# Altium schematic sheet BUTTONS&LEDS.SchDoc
size A4; DocumentNumber: 11; SheetNumber: 11; SheetTotal: 12
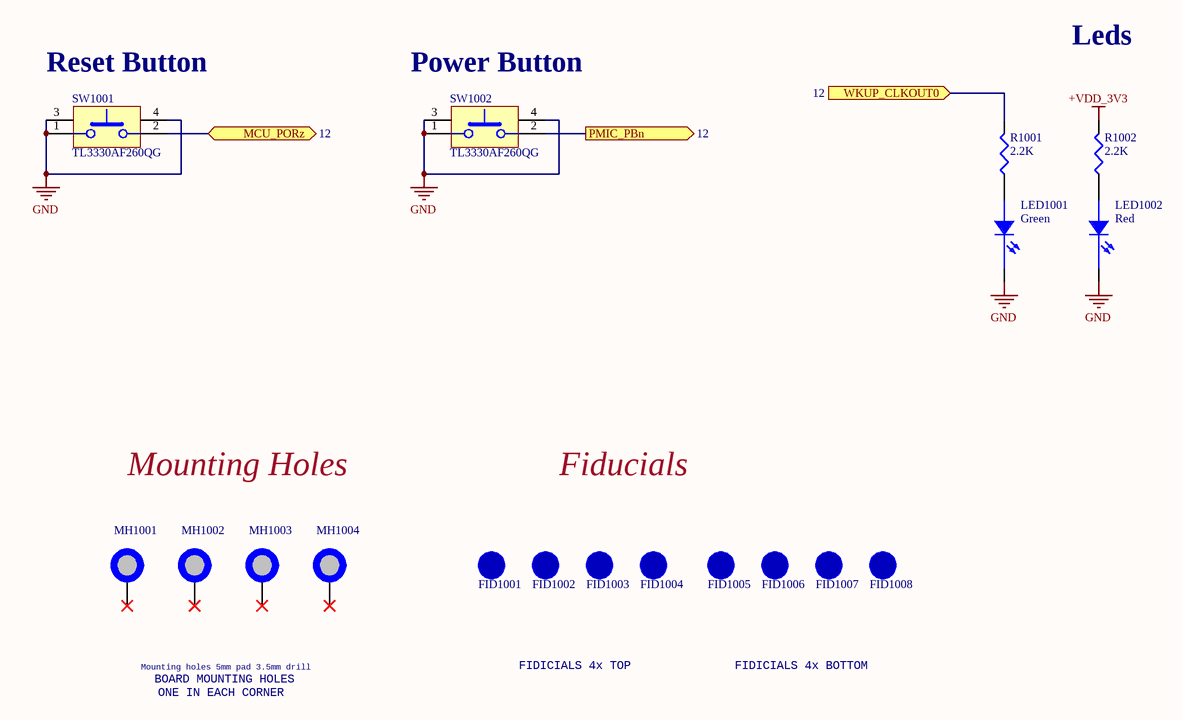
[diagram p0: BUTTONS&LEDS.SchDoc]

## Parts
FID1001  FID_1MMC  [FID_40X120D]  (value not drawn)  (no BOM)
FID1002  FID_1MMC  [FID_40X120D]  (value not drawn)  (no BOM)
FID1003  FID_1MMC  [FID_40X120D]  (value not drawn)  (no BOM)
FID1004  FID_1MMC  [FID_40X120D]  (value not drawn)  (no BOM)
FID1005  FID_1MMC  [FID_40X120D]  (value not drawn)  (no BOM)
FID1006  FID_1MMC  [FID_40X120D]  (value not drawn)  (no BOM)
FID1007  FID_1MMC  [FID_40X120D]  (value not drawn)  (no BOM)
FID1008  FID_1MMC  [FID_40X120D]  (value not drawn)  (no BOM)
LED1001  Green  [led0402_G]
LED1002  Red  [led0402_R]
MH1001  MH_5MMD_3.5MMH  [MH_5MMD_3.5MMH]  (value not drawn)
MH1002  MH_5MMD_3.5MMH  [MH_5MMD_3.5MMH]  (value not drawn)
MH1003  MH_5MMD_3.5MMH  [MH_5MMD_3.5MMH]  (value not drawn)
MH1004  MH_5MMD_3.5MMH  [MH_5MMD_3.5MMH]  (value not drawn)
R1001  2.2K  [R0402]
R1002  2.2K  [R0402]
SW1001  TL3330AF260QG  [SW_TL3330_EWI]
SW1002  TL3330AF260QG  [SW_TL3330_EWI]

## Ports
MCU_PORz (bidir, see 12), PMIC_PBn (out, see 12), WKUP_CLKOUT0 (in, see 12)

## Nets
+VDD_3V3: R1002.2
GND: LED1001.2(C) LED1002.2(C) SW1001.1 SW1001.3(MECH1) SW1001.4(MECH2) SW1002.1 SW1002.3(MECH1) SW1002.4(MECH2)
MCU_PORz: SW1001.2 ; port MCU_PORz
PMIC_PBn: SW1002.2 ; port PMIC_PBn
WKUP_CLKOUT0: R1001.2 ; port WKUP_CLKOUT0
NetLED1001_1: LED1001.1(A) R1001.1
NetLED1002_1: LED1002.1(A) R1002.1

Not connected (* = marked no-connect by the designer): MH1001 1*; MH1002 1*; MH1003 1*; MH1004 1*

## Notes on the sheet
- (near SW1001) Reset Button
- (near SW1002) Power Button
- Leds
- Mounting Holes
- Fiducials
- Mounting holes 5mm pad 3.5mm drill
- BOARD MOUNTING HOLES
- ONE IN EACH CORNER
- FIDICIALS 4x TOP
- FIDICIALS 4x BOTTOM

## Library data of the parts
FID1001-FID1008 = FID_1MMC: Fiducial 40mil Diameter, 120mil Mask; Supplier: Digikey
LED1001 = BL-HGE37A-AV-TRB: Yellow Green 0402 1X.5X4MM; Manufacturer: American Bright; Supplier 1: Digi-Key; Manufacturer Part Number: BL-HGE37A-AV-TRB; RoHS: Yes; Category: LEDs; Stock 1: 34287; Pricing 1: 1=0.34, 10=0.268, 100=0.1202, 500=0.1086, 1000=0.0892 (USD); ComponentLink1URL: http://americanbrightled.com/pdffiles/smt/BL-HGE37A-AV-TRB.pdf?src-supplier=Digi-Key; ComponentLink1Description: http://americanbrightled.com/pdffiles/smt/BL-HGE37A-AV-TRB.pdf?src-supplier=Digi-Key; ComponentLink2URL: http://www.americanbrightled.com/pdffiles/smt/BL-HGE37A-AV-TRB.pdf?src-supplier=Digi-Key; ComponentLink2Description: http://www.americanbrightled.com/pdffiles/smt/BL-HGE37A-AV-TRB.pdf?src-supplier=Digi-Key; Supplier Part Number 1: BL-HGE37A-AV-TRBCT-ND
LED1002 = SML-P12U2TT86R: LED Uni-Color Red 2-Pin Chip 0402(1006Metric) T/R; Manufacturer: Rohm; Supplier 1: Digi-Key; Manufacturer Part Number: SML-P12U2TT86R; RoHS: Yes; Category: LEDs; Stock 1: 17913; Pricing 1: 1=0.36, 10=0.236, 100=0.1577, 500=0.10908, 1000=0.0909, 2000=0.08181 (USD); ComponentLink1URL: http://www.mouser.com/ds/2/348/sml-p1-471200.pdf?src-supplier=Mouser; ComponentLink1Description: http://www.mouser.com/ds/2/348/sml-p1-471200.pdf?src-supplier=Mouser; ComponentLink2URL: https://datasheet.octopart.com/SML-P12U2TT86R-Rohm-datasheet-138791994.pdf?src-supplier=Future+Electronics; ComponentLink2Description: https://datasheet.octopart.com/SML-P12U2TT86R-Rohm-datasheet-138791994.pdf?src-supplier=Future+Electronics; ComponentLink3URL: https://www.rohm.com/datasheet/SML-P12DT(R)?src-supplier=Digi-Key; ComponentLink3Description: https://www.rohm.com/datasheet/SML-P12DT(R)?src-supplier=Digi-Key; ComponentLink4URL: https://d1d2qsbl8m0m72.cloudfront.net/en/products/databook/datasheet/opto/led/chip_mono/sml-p1-e.pdf?src-supplier=Digi-Key; ComponentLink4Description: https://d1d2qsbl8m0m72.cloudfront.net/en/products/databook/datasheet/opto/led/chip_mono/sml-p1-e.pdf?src-supplier=Digi-Key; Supplier Part Number 1: 846-1192-1-ND
MH1001-MH1004 = MH_5MMD_3.5MMH: Mounting Hole 5mm Diameter, 3.5mm Hole
R1001 R1002 = RC0402FR-072K2L: SMD Chip Resistor, 2.2 kOhm, ± 1%, 63 mW, 0402 [1005 Metric], Thick Film, General Purpose; Manufacturer: Yageo; Resistance: 2.2kR; Power Rating: 62.5mW; Voltage Rating: 50V; Temperature Coefficient: 100ppm/°C; Max Power Dissipation: 63mW; Supplier 1: Future Electronics; Manufacturer Part Number: RC0402FR-072K2L; RoHS: Yes; Category: Chip SMD Resistors; Stock 1: 70000; Pricing 1: 10000=0.0008, 50000=0.0008, 250000=0.0007, 500000=0.0007, 1500000=0.0007 (USD); Case/Package: 0402; Case Code (Imperial): 0402; Case Code (Metric): 1005; Weight: 2.3E-05oz; Size Code: 0402; Min Operating Temperature: -55°C; Max Operating Temperature: 155°C; Resistor Type: Thick Film; Packaging: Tape and Reel; Tolerance: 1%; Termination: SMD/SMT; Features: Moisture Resistant; Series: RC; Number of Terminations: 2; Resistance Tolerance: 1%; Construction: Rectangular; Technology: THICK FILM; Voltage Rating (AC): 50V; Length: 1mm; Width: 0.5mm; Height: 0.35mm; Depth: 0.5mm; RoHS Compliant: Yes; Reach SVHC Compliant: No; Military Standard: Not; Lead Free: Lead Free; ComponentLink1URL: https://datasheet.ciiva.com/11808/0900766b80c66297-11808786.pdf?src-supplier=Rs; ComponentLink1Description: https://datasheet.ciiva.com/11808/0900766b80c66297-11808786.pdf?src-supplier=Rs; ComponentLink2URL: https://datasheet.ciiva.com/7983/1018594-7983515.pdf?src-supplier=Element14; ComponentLink2Description: https://datasheet.ciiva.com/7983/1018594-7983515.pdf?src-supplier=Element14; ComponentLink3URL: https://datasheet.ciiva.com/46383/1018594-46383563.pdf?src-supplier=Element14; ComponentLink3Description: https://datasheet.ciiva.com/46383/1018594-46383563.pdf?src-supplier=Element14; ComponentLink4URL: https://datasheet.ciiva.com/12577/pyu-rc0402-51-rohs-l-6-r-12577429.pdf?src-supplier=Mouser; ComponentLink4Description: https://datasheet.ciiva.com/12577/pyu-rc0402-51-rohs-l-6-r-12577429.pdf?src-supplier=Mouser; ComponentLink5URL: https://datasheet.ciiva.com/7849/1018594-7849929.pdf?src-supplier=Element14; ComponentLink5Description: https://datasheet.ciiva.com/7849/1018594-7849929.pdf?src-supplier=Element14; ComponentLink6URL: https://datasheet.ciiva.com/7849/1018594-7849928.pdf?src-supplier=Element14; ComponentLink6Description: https://datasheet.ciiva.com/7849/1018594-7849928.pdf?src-supplier=Element14; ComponentLink7URL: https://datasheet.ciiva.com/16741/pyu-rc0402-51-rohs-l-6-r-16741015.pdf?src-supplier=Future+Electronics; ComponentLink7Description: https://datasheet.ciiva.com/16741/pyu-rc0402-51-rohs-l-6-r-16741015.pdf?src-supplier=Future+Electronics; Supplier Part Number 1: 6626931
SW1001 SW1002 = TL3330AF260QG: Switch Tactile N.O. SPST Rectangular Button Gull Wing 0.05A 12VDC 2.55N SMD; Manufacturer: E-Switch; Contact Current Rating: 50mA; Number of Positions: 2NUMBER; Supplier 1: Digikey; Manufacturer Part Number: TL3330AF260QG; RoHS: Yes; Category: Tactile Switches; Stock 1: 112482; Pricing 1: 1=0.51, 10=0.488, 25=0.47, 100=0.4068, 250=0.3706, 500=0.3435, 1000=0.30734 (USD); Height: 3.75mm; ComponentLink1URL: https://datasheet.ciiva.com/2900/p010951-2900788.pdf?src-supplier=Digikey; ComponentLink1Description: https://datasheet.ciiva.com/2900/p010951-2900788.pdf?src-supplier=Digikey; ComponentLink2URL: https://datasheet.ciiva.com/5284/tl3330-28043-5284129.pdf?src-supplier=Mouser; ComponentLink2Description: https://datasheet.ciiva.com/5284/tl3330-28043-5284129.pdf?src-supplier=Mouser; ComponentLink3URL: https://datasheet.ciiva.com/2900/tl3330-2900789.pdf?src-supplier=Digikey; ComponentLink3Description: https://datasheet.ciiva.com/2900/tl3330-2900789.pdf?src-supplier=Digikey; ComponentLink4URL: https://datasheet.ciiva.com/2900/tl3330-2900790.pdf?src-supplier=Digikey; ComponentLink4Description: https://datasheet.ciiva.com/2900/tl3330-2900790.pdf?src-supplier=Digikey; Supplier Part Number 1: EG4389CT-ND